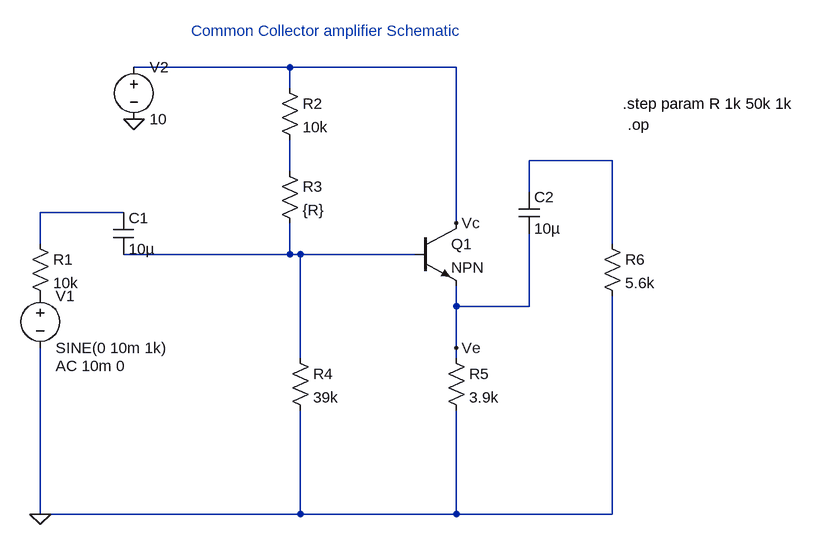
[diagram p0: schematic Lab2.asc]
Lab2.asc, the LTspice schematic file:
Version 4
SHEET 1 1264 680
WIRE 464 -128 224 -128
WIRE 720 -128 464 -128
WIRE 464 -96 464 -128
WIRE 960 16 832 16
WIRE 464 32 464 -16
WIRE 832 64 832 16
WIRE 208 96 80 96
WIRE 720 112 720 -128
WIRE 80 144 80 96
WIRE 960 144 960 16
WIRE 464 160 464 112
WIRE 464 160 208 160
WIRE 480 160 464 160
WIRE 656 160 480 160
WIRE 720 240 720 208
WIRE 832 240 832 128
WIRE 832 240 720 240
WIRE 720 304 720 240
WIRE 480 320 480 160
WIRE 720 320 720 304
WIRE 80 560 80 304
WIRE 480 560 480 400
WIRE 480 560 80 560
WIRE 720 560 720 400
WIRE 720 560 480 560
WIRE 960 560 960 224
WIRE 960 560 720 560
FLAG 224 -48 0
FLAG 80 560 0
FLAG 720 112 Vc
FLAG 720 304 Ve
SYMBOL voltage 80 208 R0
WINDOW 123 24 124 Left 2
WINDOW 39 0 0 Left 0
SYMATTR InstName V1
SYMATTR Value SINE(0 10m 1k)
SYMATTR Value2 AC 10m 0
SYMBOL voltage 224 -144 R0
WINDOW 123 0 0 Left 0
WINDOW 39 0 0 Left 0
SYMATTR InstName V2
SYMATTR Value 10
SYMBOL res 64 128 R0
SYMATTR InstName R1
SYMATTR Value 10k
SYMBOL res 448 -112 R0
SYMATTR InstName R2
SYMATTR Value 10k
SYMBOL res 448 16 R0
SYMATTR InstName R3
SYMATTR Value {R}
SYMBOL res 464 304 R0
SYMATTR InstName R4
SYMATTR Value 39k
SYMBOL res 704 304 R0
SYMATTR InstName R5
SYMATTR Value 3.9k
SYMBOL res 944 128 R0
SYMATTR InstName R6
SYMATTR Value 5.6k
SYMBOL cap 192 96 R0
SYMATTR InstName C1
SYMATTR Value 10µ
SYMBOL cap 816 64 R0
SYMATTR InstName C2
SYMATTR Value 10µ
SYMBOL npn 656 112 R0
SYMATTR InstName Q1
TEXT 976 -72 Left 2 !.step param R 1k 50k 1k
TEXT 984 -40 Left 2 !.op
TEXT 312 -184 Left 2 ;Common Collector amplifier Schematic

The netlist it stands for:
* Lab2.asc
V1 P001 0 SINE(0 10m 1k) AC 10m 0
V2 Vc 0 10
R1 N003 P001 10k
R2 Vc N002 10k
R3 N002 N004 {R}
R4 N004 0 39k
R5 Ve 0 3.9k
R6 N001 0 5.6k
C1 N003 N004 10µ
C2 N001 Ve 10µ
Q1 Vc N004 Ve 0 NPN
.model NPN NPN
.model PNP PNP
.lib standard.bjt
.step param R 1k 50k 1k
.op
* Common Collector amplifier Schematic
.backanno
.end